# EAGLE schematic 10_Board_A_V1 (EAGLE 9.5.0)
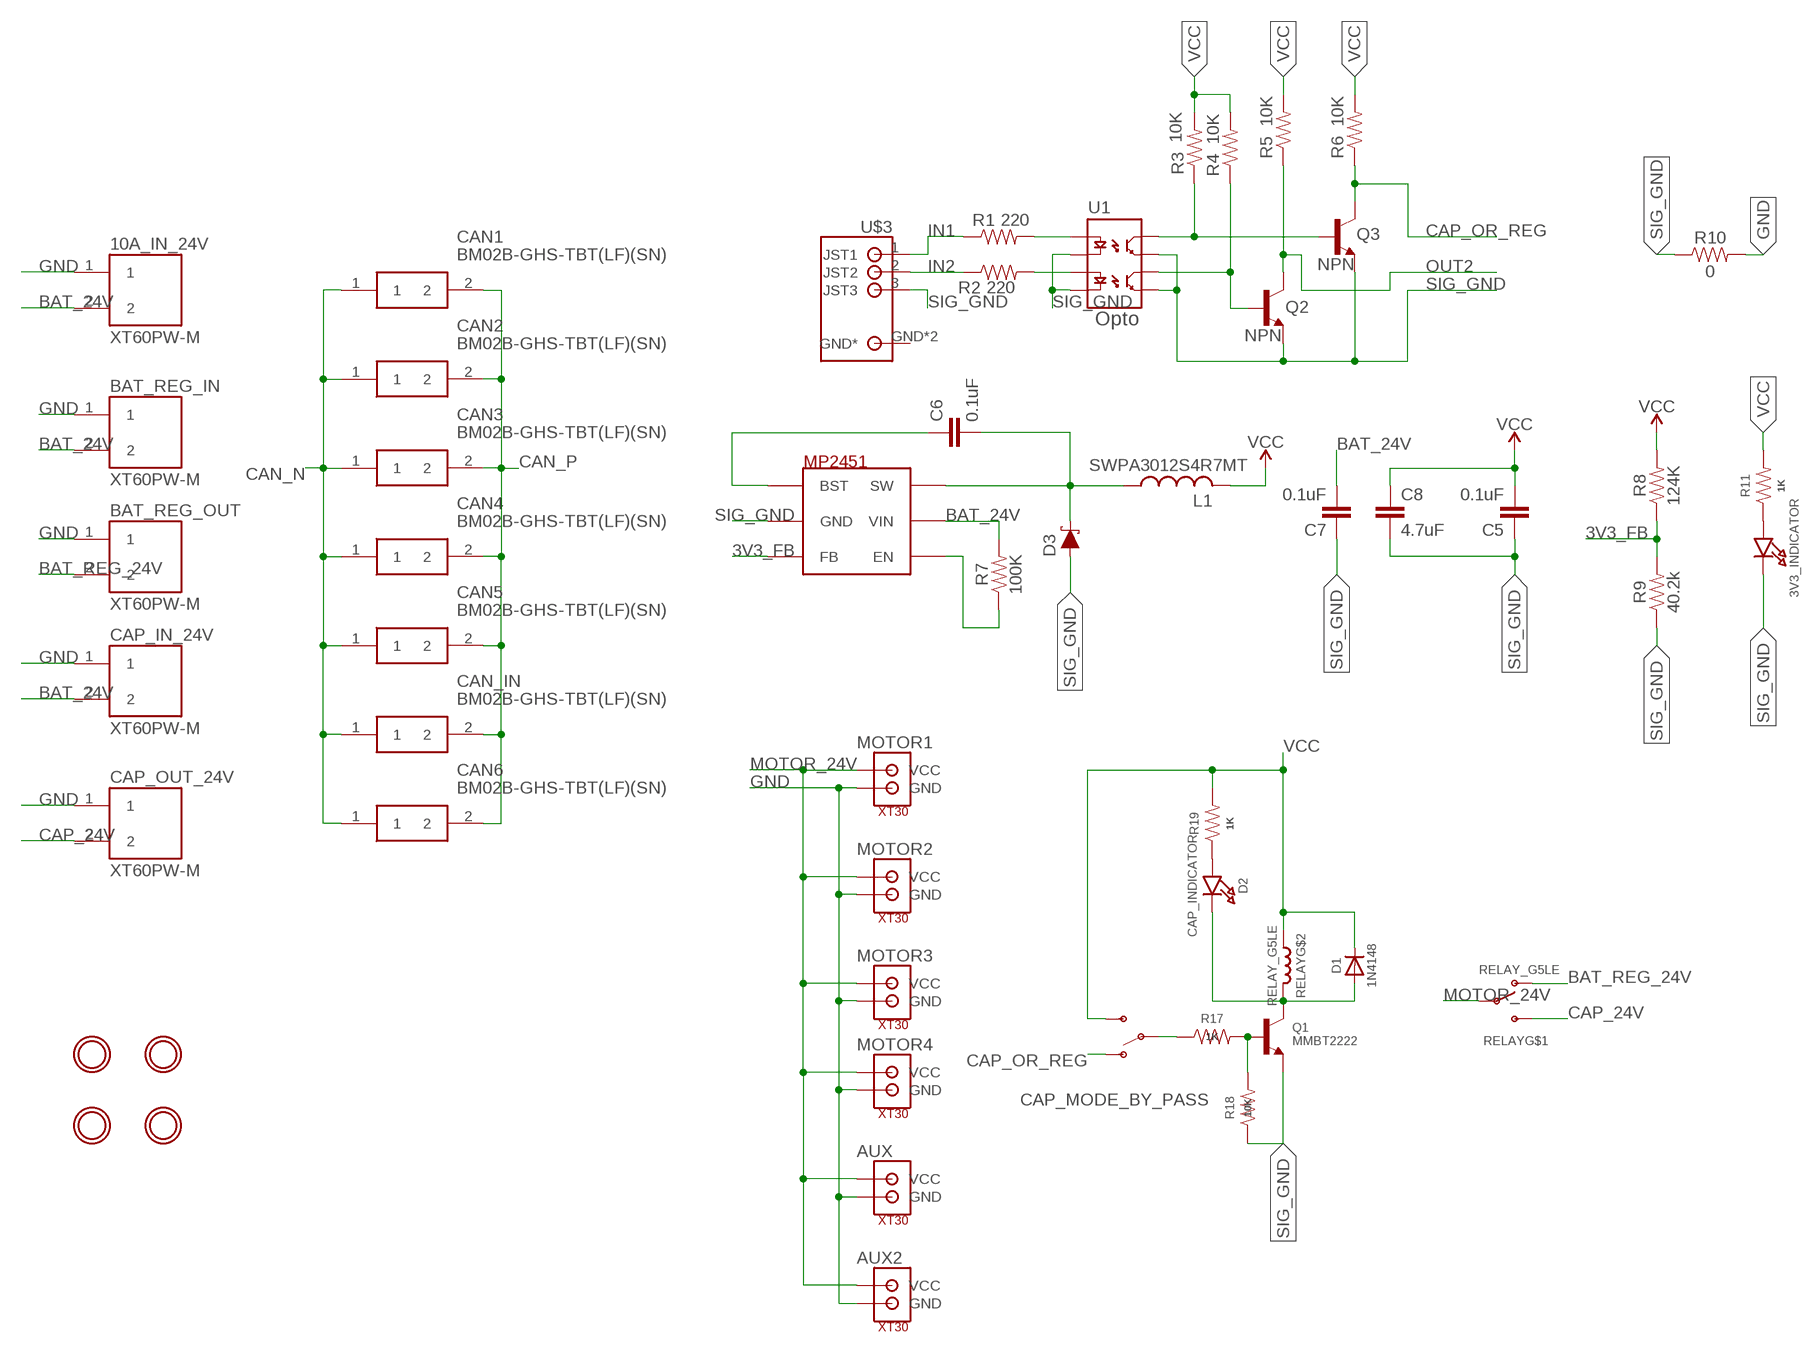
[diagram p0: schematic, sheet 1]

## Parts
3V3_INDICATOR  LED0805_NOOUTLINE  [CHIPLED_0805_NOOUTLINE]
10A_IN_24V  XT60PW-M  [AMASS_XT60PW-M]
AUX  XT30  [XT30]
AUX2  XT30  [XT30]
BAT_REG_IN  XT60PW-M  [AMASS_XT60PW-M]
BAT_REG_OUT  XT60PW-M  [AMASS_XT60PW-M]
C5  0.1uF  0.1UF-0603-25V-(+80/-20%)  [0603]
C6  0.1uF  0.1UF-0603-25V-(+80/-20%)  [0603]
C7  0.1uF  0.1UF-0603-25V-(+80/-20%)  [0603]
C8  4.7uF  4.7UF-1206-16V-(+80/-20%)  [1206]
CAN1  BM02B-GHS-TBT(LF)(SN)  [BM02B-GHS-TBT_1]
CAN2  BM02B-GHS-TBT(LF)(SN)  [BM02B-GHS-TBT_1]
CAN3  BM02B-GHS-TBT(LF)(SN)  [BM02B-GHS-TBT_1]
CAN4  BM02B-GHS-TBT(LF)(SN)  [BM02B-GHS-TBT_1]
CAN5  BM02B-GHS-TBT(LF)(SN)  [BM02B-GHS-TBT_1]
CAN6  BM02B-GHS-TBT(LF)(SN)  [BM02B-GHS-TBT_1]
CAN_IN  BM02B-GHS-TBT(LF)(SN)  [BM02B-GHS-TBT_1]
CAP_IN_24V  XT60PW-M  [AMASS_XT60PW-M]
CAP_MODE_BY_PASS  SWITCH-SPDT-SMD-RIGHT-ANGLE  [SWITCH_SPST_SMD_A]
CAP_OUT_24V  XT60PW-M  [AMASS_XT60PW-M]
D1  1N4148  DIODESOD-323  [SOD-323]
D2  CAP_INDICATOR  LED0805_NOOUTLINE  [CHIPLED_0805_NOOUTLINE]
D3  3A/40V/500mV  DIODE-SCHOTTKY-B340A  [SMA-DIODE]
L1  SWPA3012S4R7MT  L-USL3230M  [L3230M]
MOTOR1  XT30  [XT30]
MOTOR2  XT30  [XT30]
MOTOR3  XT30  [XT30]
MOTOR4  XT30  [XT30]
MP2451  MP2451  [TSOT-23-6-SOT-23-6]
Q1  MMBT2222  TRANSISTOR_NPN  [SOT23-R]
Q2  NPN  TRANSISTOR_NPNMMBT2222A  [SOT23-3]
Q3  NPN  TRANSISTOR_NPNMMBT2222A  [SOT23-3]
R1  220  220OHM-1/10W-1%(0603)  [0603-RES]
R2  220  220OHM-1/10W-1%(0603)  [0603-RES]
R3  10K  10KOHM1/10W1%(0603)0603  [0603-RES]
R4  10K  10KOHM1/10W1%(0603)0603  [0603-RES]
R5  10K  10KOHM1/10W1%(0603)0603  [0603-RES]
R6  10K  10KOHM1/10W1%(0603)0603  [0603-RES]
R7  100K  RESISTOR0603  [0603]
R8  124K  RESISTOR0603  [0603]
R9  40.2k  RESISTOR0603  [0603]
R10  0  RESISTOR1206  [1206]
R11  1K  RESISTOR0805-RES  [0805]
R17  1K  RESISTOR0805-RES  [0805]
R18  10K  RESISTOR0805-RES  [0805]
R19  1K  RESISTOR0805-RES  [0805]
RELAY  RELAY_G5LE  [RELAY_G5LE-1]
U1  OPTOISOLATOR-2SOIC8  [SO08-2]
U$1  MOUNTINGHOLE2.5  [MOUNTINGHOLE_2.5_PLATED]
U$2  MOUNTINGHOLE2.5  [MOUNTINGHOLE_2.5_PLATED]
U$3  S3B-PH-SM4_TB  [S3B-PH-SM4_TB]
U$4  MOUNTINGHOLE2.5  [MOUNTINGHOLE_2.5_PLATED]
U$49  MOUNTINGHOLE2.5  [MOUNTINGHOLE_2.5_PLATED]

## Nets
3V3_FB [sig]: MP2451.PIN3(FB) R8.1 R9.2
BAT_24V: 10A_IN_24V.2 BAT_REG_IN.2 C7.2 CAP_IN_24V.2 MP2451.PIN5(VIN) R7.2
BAT_REG_24V: BAT_REG_OUT.2 RELAY.3(O)
CAN_N [sig]: CAN1.1 CAN2.1 CAN3.1 CAN4.1 CAN5.1 CAN6.1 CAN_IN.1
CAN_P [sig]: CAN1.2 CAN2.2 CAN3.2 CAN4.2 CAN5.2 CAN6.2 CAN_IN.2
CAP_24V: CAP_OUT_24V.2 RELAY.4(S)
CAP_OR_REG [sig]: CAP_MODE_BY_PASS.1(O) Q3.3(C) R6.1
GND: 10A_IN_24V.1 AUX2.P$1(GND) AUX.P$1(GND) BAT_REG_IN.1 BAT_REG_OUT.1 CAP_IN_24V.1 CAP_OUT_24V.1 MOTOR1.P$1(GND) MOTOR2.P$1(GND) MOTOR3.P$1(GND) MOTOR4.P$1(GND) R10.2
IN1: R1.1 U$3.1(JST1)
IN2: R2.1 U$3.2(JST2)
MOTOR_24V: AUX2.P$2(VCC) AUX.P$2(VCC) MOTOR1.P$2(VCC) MOTOR2.P$2(VCC) MOTOR3.P$2(VCC) MOTOR4.P$2(VCC) RELAY.1(P)
N$1 [sig]: CAP_MODE_BY_PASS.2(P) R17.1
N$2: R1.2 U1.1(A1)
N$3: R2.2 U1.3(A2)
N$4 [sig]: MP2451.PIN4(EN) R7.1
N$5 [VCC]: C6.1 MP2451.PIN1(BST)
N$7 [VCC]: C6.2 D3.C L1.1 MP2451.PIN6(SW)
N$8: 3V3_INDICATOR.A R11.1
N$12: D1.A D2.C Q1.3(C) RELAY.5
N$22: Q1.1(B) R17.2 R18.2
N$26: D2.A R19.1
OUT1N: Q3.1(B) R3.1 U1.8(CL1)
OUT2: Q2.3(C) R5.1
OUT2N: Q2.1(B) R4.1 U1.6(CL2)
SIG_GND: 3V3_INDICATOR.C C5.1 C7.1 C8.2 D3.A MP2451.PIN2(GND) Q1.2(E) Q2.2(E) Q3.2(E) R9.1 R10.1 R18.1 U1.2(C1) U1.4(C2) U1.5(EM2) U1.7(EM1) U$3.3(JST3)
VCC [VCC]: C5.2 C8.1 CAP_MODE_BY_PASS.3(S) D1.C L1.2 R3.2 R4.2 R5.2 R6.2 R8.2 R11.2 R19.2 RELAY.2
Unconnected: U$3.GND2(GND*) U$3.GND(GND*)

## Notes on the sheet
- Opto

## Library data of the parts
3V3_INDICATOR D2 = microbuilder:LED: LED 0603 - 0603 Surface Mount Package 2mA: Green LED - Low Power (3.9mcd, 2ma, 1.7Vf) - Digikey: 475-2709-2-ND Orange LED - Low Power (9.8mcd, 2ma, 1.8Vf) - Digikey: 475-1194-2-ND Red LED - Low Power (5mcd, 2ma, 1.8Vf) - Digikey: 475-1195-2-ND Yellow LED - Low Power (7mcd, 2ma, 1.8Vf) - Digikey: 475-1196-2-ND 5mA: Blue LED - Low Power (17mcd, 5ma, 2.9Vf) - Digikey: LNJ937W8CRACT-ND 0805 - 0805 Surface Mount Package 2mA: Red LED (8.8mcd, 2mA, 1.8Vf, Clear) - Low Power [Digikey: 475-2510-1-ND] Green LED (5mcd, 2mA, 1.8Vf, Clear) - Low Power [Digikey: 475-2730-1-ND] Yellow LED (11.3mcd, 2mA, 1.8Vf, Clear) - Low Power [Digikey: 475-2555-1-ND] 20mA: Red LED (104mcd, 20mA, Diffused) - LS R976 [Digikey: 475-1278-6-ND] Red LED (12mcd, 20mA, 2.0Vf, Clear) - APT2012EC [Digikey: 754-1128-1-ND] Green LED (15mcd, 20mA, 2.2Vf, Clear) - APT2012GC [Digikey: 754-1131-1-ND] Orange LED (160mcd, 20mA, 2.1Vf, Clear) - APT2012SECK [Digikey: 754-1130-1-ND] 1206 - 1206 Surface Mount Package Green LED (26mcd, 20mA, Diffused) - LG N971 [Digikey: 475-1407-6-ND] Red LED (15mcd, 20mA, Diffused) - LH N974 [Digikey: 475-1416-6-ND] Cree - Cree High-Power Surface Mount LEDs XPEBWT-L1-0000-00D50 - White 111lm 350mA 2.9Vf 6200K 110° XTEAWT-00-0000-00000LEE3 - White 114lm 350mA 2.85Vf 5000K 115° Everlight - Everlight 45-21 Series Surface Mount LEDs 45-21/QK2C-B2832AC2CB2/2T - Warm White 2000mcd 20mA 3.25Vf 3050K 120° 45-21/LK2C-B38452C4CB2/2T - Nuetral White 2000mcd 20mA 3.25Vf 4150K 120° 45-21/LK2C-B50634C6CB2/2T - Cold White 2200mcd 20mA 3.25Vf 5650K 120° PLCC2 Reverse Mount LS T77K-J1L2-1-0-2-R18-Z - Red 11.25mcd 2mA 1.8Vf 630nm 120° LO T77K-L1M2-24-Z - Orange 19.6mcd 2mA 1.8Vf 606nm 120° LY T77K-K2M1-26-Z - Yellow 15.7mcd 2mA 1.8Vf 587nm 120°
10A_IN_24V BAT_REG_IN BAT_REG_OUT CAP_IN_24V CAP_OUT_24V = XT60PW-M:XT60PW-M; AVAILABILITY: Unavailable; MF: AMASS; MP: XT60PW-M; PACKAGE: Package Analog Devices; PRICE: None
AUX AUX2 MOTOR1-MOTOR4 = NewKevinMade:XT30
C5-C7 = SparkFun-Capacitors:0.1UF: 0.1µF ceramic capacitors A capacitor is a passive two-terminal electrical component used to store electrical energy temporarily in an electric field.; PROD_ID: CAP-00810
C8 = SparkFun-Capacitors:4.7UF: 4.7µF ceramic capacitors A capacitor is a passive two-terminal electrical component used to store electrical energy temporarily in an electric field.; PROD_ID: CAP-10300
CAN1-CAN6 CAN_IN = SamacSys_Parts:BM02B-GHS-TBT(LF)(SN): GH 1.25mm header top entry 2 way JST GH Series, 1.25mm Pitch 2 Way Shrouded Straight PCB Header, Surface Mount, Solder Termination Source: Datasheet <http://uk.rs-online.com/web/p/products/7521762P>; DESCRIPTION: GH 1.25mm header top entry 2 way JST GH Series, 1.25mm Pitch 2 Way Shrouded Straight PCB Header, Surface Mount, Solder Termination; HEIGHT: mm; MANUFACTURER_NAME: JST (JAPAN SOLDERLESS TERMINALS); MANUFACTURER_PART_NUMBER: BM02B-GHS-TBT(LF)(SN); RS_PART_NUMBER: 7521762P
CAP_MODE_BY_PASS = SparkFun-Switches:SWITCH-SPDT: Single Pole, Double Throw (SPDT) Switch Single-pole, double-throw (SPDT) switch. Variant Overview SMD-AYZ0202 Surface Mount DPDT Switch <https://www.sparkfun.com/products/597> (COM-00597) Used on e.g. LilyPad Arduino USB - ATmega32U4 Board <https://www.sparkfun.com/products/12049> PTH-11.6X4.0MM SPDT Mini Power Switch <https://www.sparkfun.com/products/102> (COM-00102) Used on e.g. SparkFun Simon Says - Through-Hole Soldering Kit <https://www.sparkfun.com/products/10547> (KIT-10547) PTH-11.6X4.0MM-KIT KIT version of SPDT Mini Power Switch - Simplifies soldering by removing tStop of switch pins - only one side can be soldered. PTH-11.6X4.0MM-LOCK LOCK version of SPDT Mini Power Switch - Offset pins hold switch in place for easier soldering. SMD-RIGHT-ANGLE Surface Mount Right Angle Switch <https://www.sparkfun.com/products/10860> (COM-10860) Used on e.g. SparkFun ESP8266 Thing <https://www.sparkfun.com/products/13231>; PROD_ID: SWCH-10651; SF_SKU: COM-10860
D1 = microbuilder:DIODE: Diode SMA Model Volts Amps Type Vf Ir Digikey # Notes SSA34-E3 40V 3A Schottky 480mV @ 3A 200uA @ 40V SSA34-E3/61TGITR-ND CDBA120-G 20V 1A Schottky 500mV @ 1A 500uA @ 20V 641-1014-6-ND REEL MBRA210 10V 2A Schottky 350mV @ 2A 700uA @ 10V MBRA210LT3 SOD-123 Model Volts Amps Type Vf Ir Order # Notes BAT54T1G 30V 200mA Schottky 800mV @ 200mA 2uA @ 25V BAT54T1GOSTR-ND B0530W 30V 500mA Schottky 430mV @ 500mA 130uA @ 30V B0530W-FDICT-ND REEL MBR120 20V 1A Schottky 340mV @ 1A MBR120VLSFT1GOSCT-ND SOD-323 Model Volts Amps Type Vf Ir Order # Notes PMEG2005EJ 20V 500mA Schottky 355mV @ 500mA 568-4110-1-ND ZLLS410 10V 570mA Schottky 380mV @ 570mA ZLLS410CT-ND 1N4148WS 75V 150mA Silicon/Simple 1V 1N4148WSFSCT-ND REEL SOD-523 Model Volts Amps Type Vf Ir Order # Notes BAT54XV2 30V 200mA Schottky 0.8V @ 100mA BAT54XV2CT-ND TB751S 30V 30mA Schottky RB751S-40TE61CT-ND SOT23-R/W (R = Solder Paste/Reflow Ovens, W = Hand-Soldering) Model Volts Amps Type Vf Ir Order # Notes BAT54FILM 40V 300mA Schottky 497-7162-1-ND POWERDI-5 Model Volts Amps Type Vf Ir Order # Notes PDS560 60V 5A Schottky 670mV @ 5A 150uA @ 60V PDS560DICT-ND
D3 = SparkFun-DiscreteSemi:DIODE-SCHOTTKY: Schottky diode A Schottky diode is a semiconductor diode which has a low forward voltage drop and a very fast switching action.; PROD_ID: DIO-09886
L1 = rcl:L-US: INDUCTOR, American symbol; SPICEPREFIX: L
MP2451 = NewKevinMade:MP2451
Q1 = microbuilder:TRANSISTOR_NPN: NPN Transistor Transistor (NPN) 500mA 45V - BC817 [Digikey: 568-1631-1-ND] Transistor (NPN) 500mA 45V - BC817,215 [Mouser: 771-BC817-T/R] SOT23-R - SOT23 footprint optimised for use with solder paste and reflow ovens. SOT23-W - SOT23 footprint optimised for hand-soldering (larger pads).
Q2 Q3 = SparkFun-DiscreteSemi:TRANSISTOR_NPN: Generic NPN BJT MMBT2222A - TRANS-08049 (SOT-23, 1A 40V) MPSA42 - TRANS-09116 (SOT-23, 500mA 300V) MMBT5088LT1G - TRANS-11160 (SOT-23, 50 mA 30V) BC547 - COM-08928 <http://www.sparkfun.com/products/8928> (TO-92 45V 100mA) (1.Collector 2.Base 3.Emitter) 2N3904 - COM-00521 <http://www.sparkfun.com/products/521> (TO-92 40V 200mA) (1.Emitter 2.Base 3.Collector) P2N2222A - COM-12852 <http://www.sparkfun.com/products/12852> (TO-92 40V 600mA) (1.Collector 2.Base 3.Emitter); PROD_ID: TRANS-08049; VALUE: MMBT2222A
R1 R2 = SparkFun-Resistors:220OHM-1/10W-1%(0603): RES-07861; PROD_ID: RES-07861
R3-R6 = SparkFun-Resistors:10KOHM1/10W1%(0603): RES-00824; PROD_ID: RES-00824
R7-R10 = SparkFun-Resistors:RESISTOR: Generic Resistor Package
R11 R17-R19 = SparkFun-Resistors:RESISTOR: Resistor Basic schematic elements and footprints for 0603, 1206, and PTH resistors.
RELAY = microbuilder:RELAY_G5LE
U1 = SparkFun-DiscreteSemi:OPTOISOLATOR-2: Description: Dual gate opto isolator. Vishay part : ILD213T; PROD_ID: IC-09076
U$1 U$2 U$4 U$49 = microbuilder:MOUNTINGHOLE: Mounting Hole For #2 screws (0.086"/2.18mm width, 0.094"/2.4mm hole) use 2.5mm; BOM: EXCLUDE
U$3 = NewKevinMade:S3B-PH-SM4_TB

## Net classes
0 default: width 0.305 mm, drill 0.305 mm, clearance 0.305 mm
1 sig: width 0.254 mm, drill 0.305 mm, clearance 0.127 mm
2 VCC: width 0.254 mm, drill 0.254 mm, clearance 0.127 mm